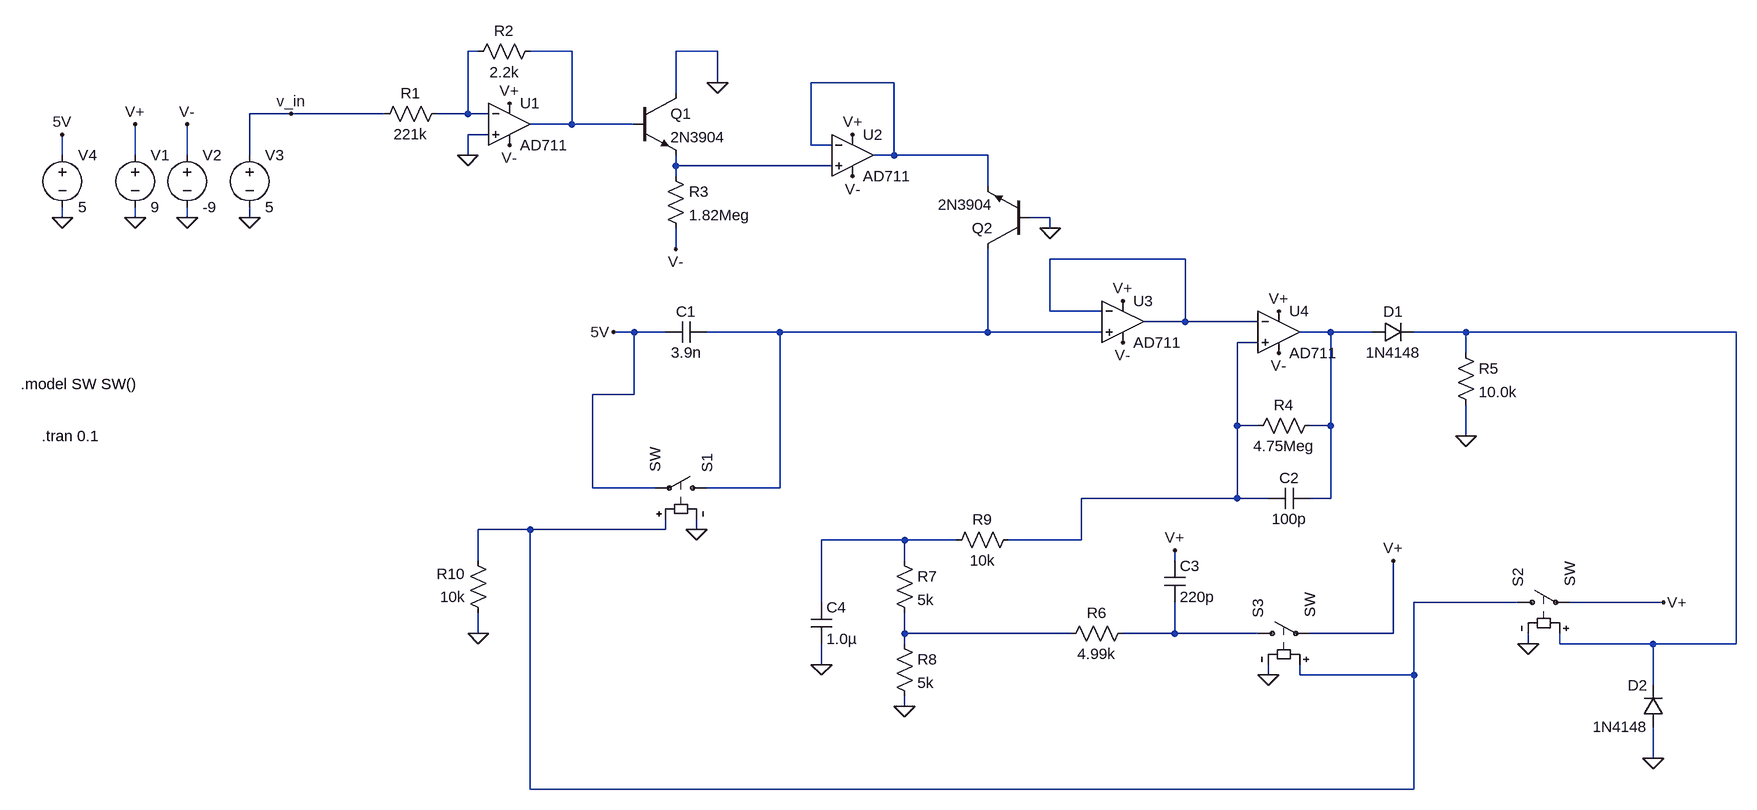
[diagram p0: schematic moog werkstatt vco.asc]
moog werkstatt vco.asc, the LTspice schematic file:
Version 4.1
SHEET 1 2776 1144
WIRE 496 -16 480 -16
WIRE 640 -16 576 -16
WIRE 864 -16 800 -16
WIRE 864 32 864 -16
WIRE 1136 32 1008 32
WIRE 800 48 800 -16
WIRE 208 80 144 80
WIRE 352 80 208 80
WIRE 480 80 480 -16
WIRE 480 80 432 80
WIRE 512 80 480 80
WIRE 640 96 640 -16
WIRE 640 96 576 96
WIRE 736 96 640 96
WIRE 512 112 480 112
WIRE 1008 128 1008 32
WIRE 1040 128 1008 128
WIRE -144 144 -144 112
WIRE -32 144 -32 96
WIRE 48 144 48 96
WIRE 144 144 144 80
WIRE 480 144 480 112
WIRE 1136 144 1136 32
WIRE 1136 144 1104 144
WIRE 1280 144 1136 144
WIRE 800 160 800 144
WIRE 1040 160 800 160
WIRE 800 176 800 160
WIRE 1280 192 1280 144
WIRE -144 240 -144 224
WIRE -32 240 -32 224
WIRE 48 240 48 224
WIRE 144 240 144 224
WIRE 1376 240 1344 240
WIRE 1376 256 1376 240
WIRE 800 288 800 256
WIRE 1584 304 1376 304
WIRE 1376 384 1376 304
WIRE 1456 384 1376 384
WIRE 1584 400 1584 304
WIRE 1584 400 1520 400
WIRE 1696 400 1584 400
WIRE 736 416 704 416
WIRE 784 416 736 416
WIRE 960 416 848 416
WIRE 1280 416 1280 288
WIRE 1280 416 960 416
WIRE 1456 416 1280 416
WIRE 1808 416 1760 416
WIRE 1872 416 1808 416
WIRE 2016 416 1936 416
WIRE 2432 416 2016 416
WIRE 1696 432 1664 432
WIRE 2016 448 2016 416
WIRE 736 512 736 416
WIRE 736 512 672 512
WIRE 1664 560 1664 432
WIRE 1696 560 1664 560
WIRE 1808 560 1808 416
WIRE 1808 560 1776 560
WIRE 2016 576 2016 528
WIRE 672 656 672 512
WIRE 768 656 672 656
WIRE 960 656 960 416
WIRE 960 656 848 656
WIRE 1664 672 1664 560
WIRE 1664 672 1424 672
WIRE 1712 672 1664 672
WIRE 1808 672 1808 560
WIRE 1808 672 1776 672
WIRE 576 720 496 720
WIRE 784 720 784 704
WIRE 784 720 576 720
WIRE 832 720 832 704
WIRE 1152 736 1024 736
WIRE 1232 736 1152 736
WIRE 1424 736 1424 672
WIRE 1424 736 1312 736
WIRE 496 768 496 720
WIRE 1152 768 1152 736
WIRE 1568 768 1568 752
WIRE 1024 832 1024 736
WIRE 2096 832 1936 832
WIRE 2320 832 2176 832
WIRE 496 880 496 848
WIRE 1152 880 1152 848
WIRE 1408 880 1152 880
WIRE 1568 880 1568 832
WIRE 1568 880 1488 880
WIRE 1696 880 1568 880
WIRE 1904 880 1904 768
WIRE 1904 880 1776 880
WIRE 1152 896 1152 880
WIRE 2112 896 2112 880
WIRE 2160 896 2160 880
WIRE 2304 896 2160 896
WIRE 2432 896 2432 416
WIRE 2432 896 2304 896
WIRE 1024 928 1024 896
WIRE 1712 944 1712 928
WIRE 1760 944 1760 928
WIRE 1936 944 1936 832
WIRE 1936 944 1760 944
WIRE 2304 960 2304 896
WIRE 1152 992 1152 976
WIRE 2304 1072 2304 1024
WIRE 576 1120 576 720
WIRE 1936 1120 1936 944
WIRE 1936 1120 576 1120
FLAG -32 240 0
FLAG 48 240 0
FLAG 144 240 0
FLAG -32 96 V+
FLAG 48 96 V-
FLAG 208 80 v_in
FLAG 480 144 0
FLAG 544 128 V-
FLAG 544 64 V+
FLAG 800 288 V-
FLAG 864 32 0
FLAG 1072 176 V-
FLAG 1072 112 V+
FLAG 1376 256 0
FLAG -144 240 0
FLAG -144 112 5V
FLAG 704 416 5V
FLAG 1488 432 V-
FLAG 1488 368 V+
FLAG 1728 448 V-
FLAG 1728 384 V+
FLAG 2016 576 0
FLAG 2304 1072 0
FLAG 2320 832 V+
FLAG 1568 752 V+
FLAG 1152 992 0
FLAG 1024 928 0
FLAG 832 720 0
FLAG 1904 768 V+
FLAG 496 880 0
FLAG 2112 896 0
FLAG 1712 944 0
SYMBOL voltage -32 128 R0
WINDOW 123 0 0 Left 0
WINDOW 39 0 0 Left 0
SYMATTR InstName V1
SYMATTR Value 9
SYMBOL voltage 48 128 R0
WINDOW 123 0 0 Left 0
WINDOW 39 0 0 Left 0
SYMATTR InstName V2
SYMATTR Value -9
SYMBOL voltage 144 128 R0
WINDOW 123 0 0 Left 0
WINDOW 39 0 0 Left 0
SYMATTR InstName V3
SYMATTR Value 5
SYMBOL OpAmps\\AD711 544 32 R0
SYMATTR InstName U1
SYMBOL res 448 64 R90
WINDOW 0 0 56 VBottom 2
WINDOW 3 32 56 VTop 2
SYMATTR InstName R1
SYMATTR Value 221k
SYMBOL res 592 -32 R90
WINDOW 0 0 56 VBottom 2
WINDOW 3 32 56 VTop 2
SYMATTR InstName R2
SYMATTR Value 2.2k
SYMBOL npn 736 48 R0
SYMATTR InstName Q1
SYMATTR Value 2N3904
SYMBOL res 784 160 R0
SYMATTR InstName R3
SYMATTR Value 1.82Meg
SYMBOL OpAmps\\AD711 1072 80 R0
SYMATTR InstName U2
SYMBOL npn 1344 288 R180
SYMATTR InstName Q2
SYMATTR Value 2N3904
SYMBOL voltage -144 128 R0
WINDOW 123 0 0 Left 0
WINDOW 39 0 0 Left 0
SYMATTR InstName V4
SYMATTR Value 5
SYMBOL cap 848 400 R90
WINDOW 0 0 32 VBottom 2
WINDOW 3 32 32 VTop 2
SYMATTR InstName C1
SYMATTR Value 3.9n
SYMBOL OpAmps\\AD711 1488 336 R0
SYMATTR InstName U3
SYMBOL OpAmps\\AD711 1728 352 R0
SYMATTR InstName U4
SYMBOL diode 1872 432 R270
WINDOW 0 32 32 VTop 2
WINDOW 3 0 32 VBottom 2
SYMATTR InstName D1
SYMATTR Value 1N4148
SYMBOL res 1792 544 R90
WINDOW 0 0 56 VBottom 2
WINDOW 3 32 56 VTop 2
SYMATTR InstName R4
SYMATTR Value 4.75Meg
SYMBOL cap 1776 656 R90
WINDOW 0 0 32 VBottom 2
WINDOW 3 32 32 VTop 2
SYMATTR InstName C2
SYMATTR Value 100p
SYMBOL res 2000 432 R0
SYMATTR InstName R5
SYMATTR Value 10.0k
SYMBOL diode 2320 1024 R180
WINDOW 0 24 64 Left 2
WINDOW 3 24 0 Left 2
SYMATTR InstName D2
SYMATTR Value 1N4148
SYMBOL cap 1552 768 R0
SYMATTR InstName C3
SYMATTR Value 220p
SYMBOL res 1504 864 R90
WINDOW 0 0 56 VBottom 2
WINDOW 3 32 56 VTop 2
SYMATTR InstName R6
SYMATTR Value 4.99k
SYMBOL res 1136 752 R0
SYMATTR InstName R7
SYMATTR Value 5k
SYMBOL res 1136 880 R0
SYMATTR InstName R8
SYMATTR Value 5k
SYMBOL cap 1008 832 R0
SYMATTR InstName C4
SYMATTR Value 1.0µ
SYMBOL res 1328 720 R90
WINDOW 0 0 56 VBottom 2
WINDOW 3 32 56 VTop 2
SYMATTR InstName R9
SYMATTR Value 10k
SYMBOL res 512 864 R180
WINDOW 0 36 76 Left 2
WINDOW 3 36 40 Left 2
SYMATTR InstName R10
SYMATTR Value 10k
SYMBOL sw 864 656 M270
SYMATTR InstName S1
SYMBOL sw 2080 832 R270
SYMATTR InstName S2
SYMBOL sw 1680 880 R270
SYMATTR InstName S3
TEXT -176 576 Left 2 !.tran 0.1
TEXT -208 496 Left 2 !.model SW SW()

The netlist it stands for:
* moog werkstatt vco.asc
V1 V+ 0 9
V2 V- 0 -9
V3 v_in 0 5
X§U1 0 N001 V+ V- N002 AD712  ; AD711, pins In+ In- V+ V- OUT
R1 N001 v_in 221k
R2 N002 N001 2.2k
Q1 0 N002 N004 0 2N3904
R3 N004 V- 1.82Meg
X§U2 N004 N003 V+ V- N003 AD712  ; AD711, pins In+ In- V+ V- OUT
Q2 N006 0 N003 0 2N3904
V4 5V 0 5
C1 N006 5V 3.9n
X§U3 N006 N005 V+ V- N005 AD712  ; AD711, pins In+ In- V+ V- OUT
X§U4 N009 N005 V+ V- N007 AD712  ; AD711, pins In+ In- V+ V- OUT
D1 N007 N008 1N4148
R4 N007 N009 4.75Meg
C2 N007 N009 100p
R5 N008 0 10.0k
D2 0 N008 1N4148
C3 V+ N013 220p
R6 N013 N012 4.99k
R7 N011 N012 5k
R8 N012 0 5k
C4 N011 0 1.0µ
R9 N009 N011 10k
R10 0 N010 10k
S1 N006 5V N010 0 SW
S2 N010 V+ N008 0 SW
S3 N013 V+ N010 0 SW
.model D D
.lib standard.dio
.model NPN NPN
.model PNP PNP
.lib standard.bjt
.tran 0.1
.model SW SW()
.lib ADI1.lib
.backanno
.end